# Altium schematic sheet slave.SchDoc
size 420 x 297 mm; SheetNumber: 3; SheetTotal: 9; Обозначение документа: QFP  slave; Номер листа: 3; Общее количество листов: 9
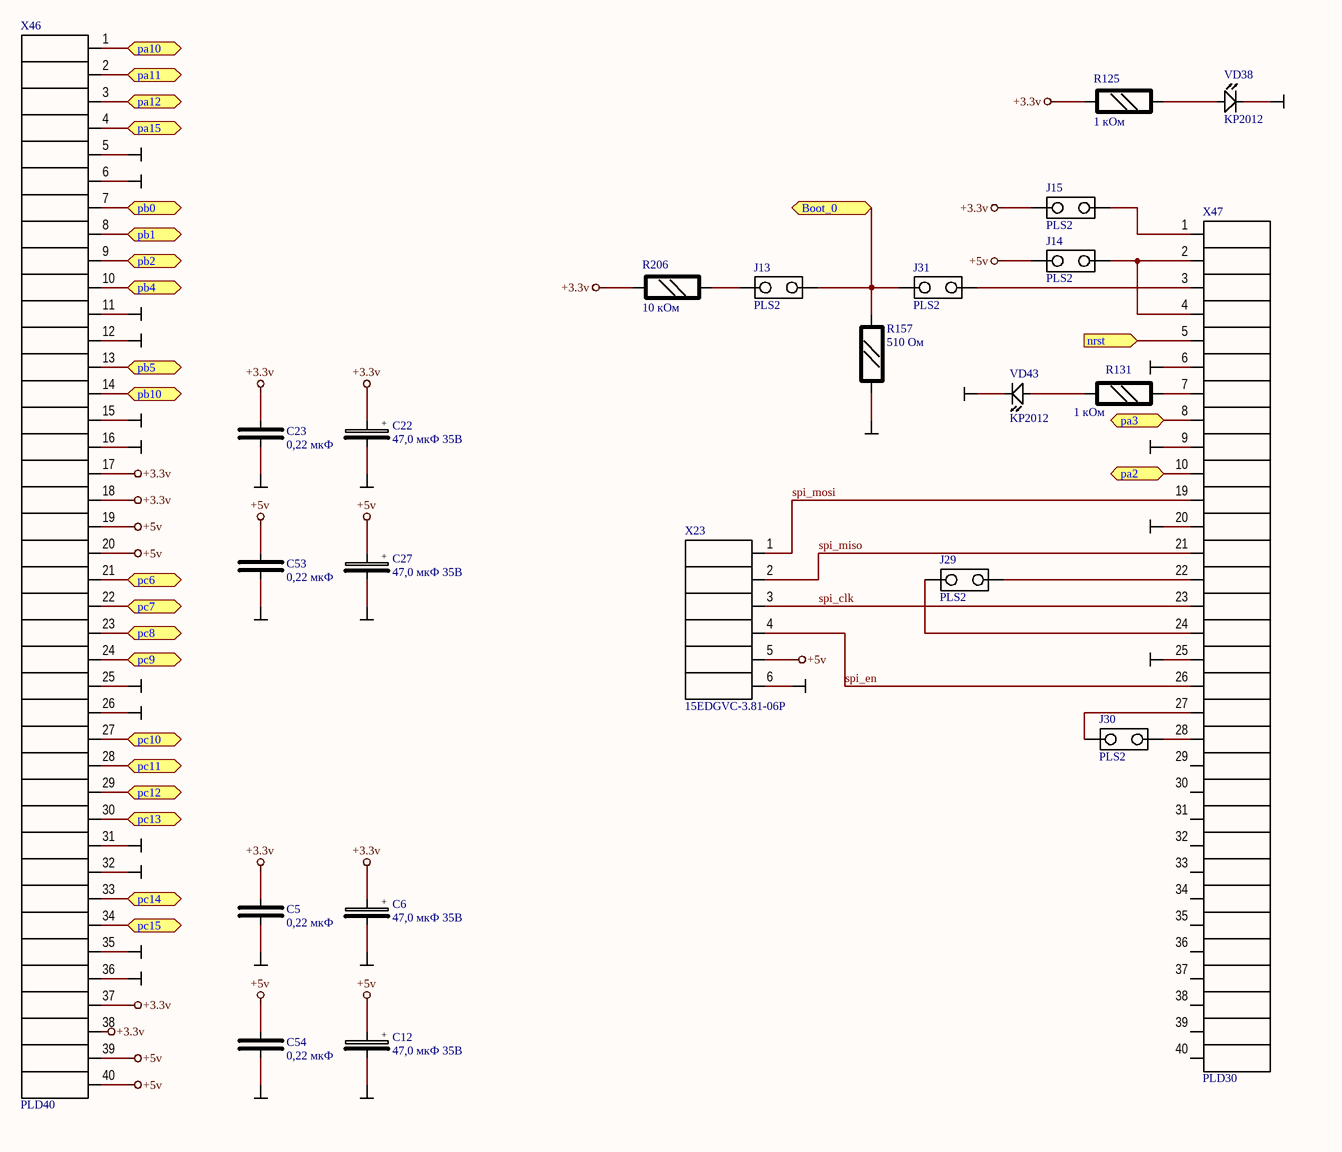
[diagram p0: slave.SchDoc]

## Parts
C5  0,22 мкФ  [SMD0805CAP]
C6  47,0 мкФ 35В  [cap6]
C12  47,0 мкФ 35В  [cap6]
C22  47,0 мкФ 35В  [cap6]
C23  0,22 мкФ  [SMD0805CAP]
C27  47,0 мкФ 35В  [cap6]
C53  0,22 мкФ  [SMD0805CAP]
C54  0,22 мкФ  [SMD0805CAP]
J13  PLS2  [PLS2]
J14  PLS2  [PLS2]
J15  PLS2  [PLS2]
J29  PLS2  [PLS2]
J30  PLS2  [PLS2]
J31  PLS2  [PLS2]
R125  1 кОм  [SMD0805RES]
R131  1 кОм  [SMD0805RES]
R157  510 Ом  [SMD0805RES]
R206  10 кОм  [SMD0805RES]
VD38  KP2012  [SMD0805DIO_C]
VD43  KP2012  [SMD0805DIO_C]
X23  15EDGVC-3.81-06P  [15EDGVC_081_6]
X46  PLD40  [PLD40_n]
X47  PLD30  [PLD40]

## Ports
nrst (in), pa2 (bidir), pa3 (bidir), pa10 (bidir), pa11 (bidir), pa12 (bidir), pa15 (bidir), pb0 (bidir), pb1 (bidir), pb2 (bidir), pb4 (bidir), pb5 (bidir), pb10 (bidir), pс6 (bidir), pс7 (bidir), pс8 (bidir), pс9 (bidir), pс10 (bidir), pс11 (bidir), pс12 (bidir), pс13 (bidir), pс14 (bidir), pс15 (bidir), Вооt_0 (bidir)

## Nets
+3.3v: C5.1 C6.1(+) C22.1(+) C23.1 J15.1 R125.2 R206.2 X46.17 X46.18 X46.37 X46.38
+5v: C12.1(+) C27.1(+) C53.1 C54.1 J14.1 X23.5 X46.19 X46.20 X46.39 X46.40
GND: C5.2 C6.2(-) C12.2(-) C22.2(-) C23.2 C27.2(-) C53.2 C54.2 R157.2 VD38.1(Cathode) VD43.1(Cathode) X23.6 X46.5 X46.6 X46.11 X46.12 X46.15 X46.16 X46.25 X46.26 X46.31 X46.32 X46.35 X46.36 X47.6 X47.9 X47.20 X47.25
nrst: X47.5 ; port nrst
pa2: X47.10 ; port pa2
pa3: X47.8 ; port pa3
pa10: X46.1 ; port pa10
pa11: X46.2 ; port pa11
pa12: X46.3 ; port pa12
pa15: X46.4 ; port pa15
pb0: X46.7 ; port pb0
pb1: X46.8 ; port pb1
pb2: X46.9 ; port pb2
pb4: X46.10 ; port pb4
pb5: X46.13 ; port pb5
pb10: X46.14 ; port pb10
pс6: X46.21 ; port pс6
pс7: X46.22 ; port pс7
pс8: X46.23 ; port pс8
pс9: X46.24 ; port pс9
pс10: X46.27 ; port pс10
pс11: X46.28 ; port pс11
pс12: X46.29 ; port pс12
pс13: X46.30 ; port pс13
pс14: X46.33 ; port pс14
pс15: X46.34 ; port pс15
spi_clk: X23.3 X47.23
spi_en: X23.4 X47.26
spi_miso: X23.2 X47.21
spi_mosi: X23.1 X47.19
Вооt_0: J13.1 J31.2 R157.1 ; port Вооt_0
NetJ13_2: J13.2 R206.1
NetJ14_2: J14.2 X47.2 X47.4
NetJ15_2: J15.2 X47.1
NetJ29_1: J29.1 X47.24
NetJ29_2: J29.2 X47.22
NetJ30_1: J30.1 X47.27
NetJ30_2: J30.2 X47.28
NetJ31_1: J31.1 X47.3
NetR125_1: R125.1 VD38.2(Anode)
NetR131_1: R131.1 X47.7
NetR131_2: R131.2 VD43.2(Anode)

Not connected (* = marked no-connect by the designer): X47 29 30 31 32 33 34 35 36 37 38 39 40

## Notes on the sheet
- Подп. и дата
- Инв. № дубл.
- Взам. инв. №
- Инв. № подл.
- Изм.
- Лист
- № докум.
- Подп.
- Дата
- Копировал
- Формат А3

## Library data of the parts
C5 C23 C53 C54 = C0805: Чип конденсатор 0805; Voltage: 50V; Vendor: Generic; Temp: Y5V; Tol: 20%; SolderOpton: Norm; Value: 0,22 мкФ; Price: 2
C6 C12 C22 C27 = C_e: 5мм Электролитический конденсатор; SolderOption: Norm; Value: 47,0 мкФ 35В
J13-J15 J29-J31 = PLS2: Джампер PLS2 2.54мм; SolderOption: Norm; Price: 1; Vendor: *; Value: PLS2
R125 R131 R157 R206 = R0805: Чип резистор 0805; Vendor: Generic; Tolerance: 5%; SolderOpton: Norm; Price: 2
  R125 R131: Value: 1 кОм
  R157: Value: 510 Ом
  R206: Value: 10 кОм
VD38 VD43 = KP2012_C: Чип светодиод 0805; Vendor: KB; Color: Green; SolderOpton: Norm; Price: 20; Value: KP2012
X23 = 15EDGVC-3.81-06P: Вилка  6/3.81; Vendor: Degson; Current: 8А; Voltage: 2кВ; Price: 50; Value: 15EDGVC-3.81-06P
X46 = PLD40: Вилка  PLD 40/2.54; Vendor: Confly; SolderOption: Norm; Price: 20; Value: PLD40
X47 = PLD30: Вилка  PLD 30/2.54; Vendor: Confly; SolderOption: Norm; Price: 20; Value: PLD30